# Altium schematic sheet MiCore_MCU.SchDoc: MiCore - Main
size A4; DrawnBy: eleqian; Revision: 1.0; SheetNumber: 1; SheetTotal: 3
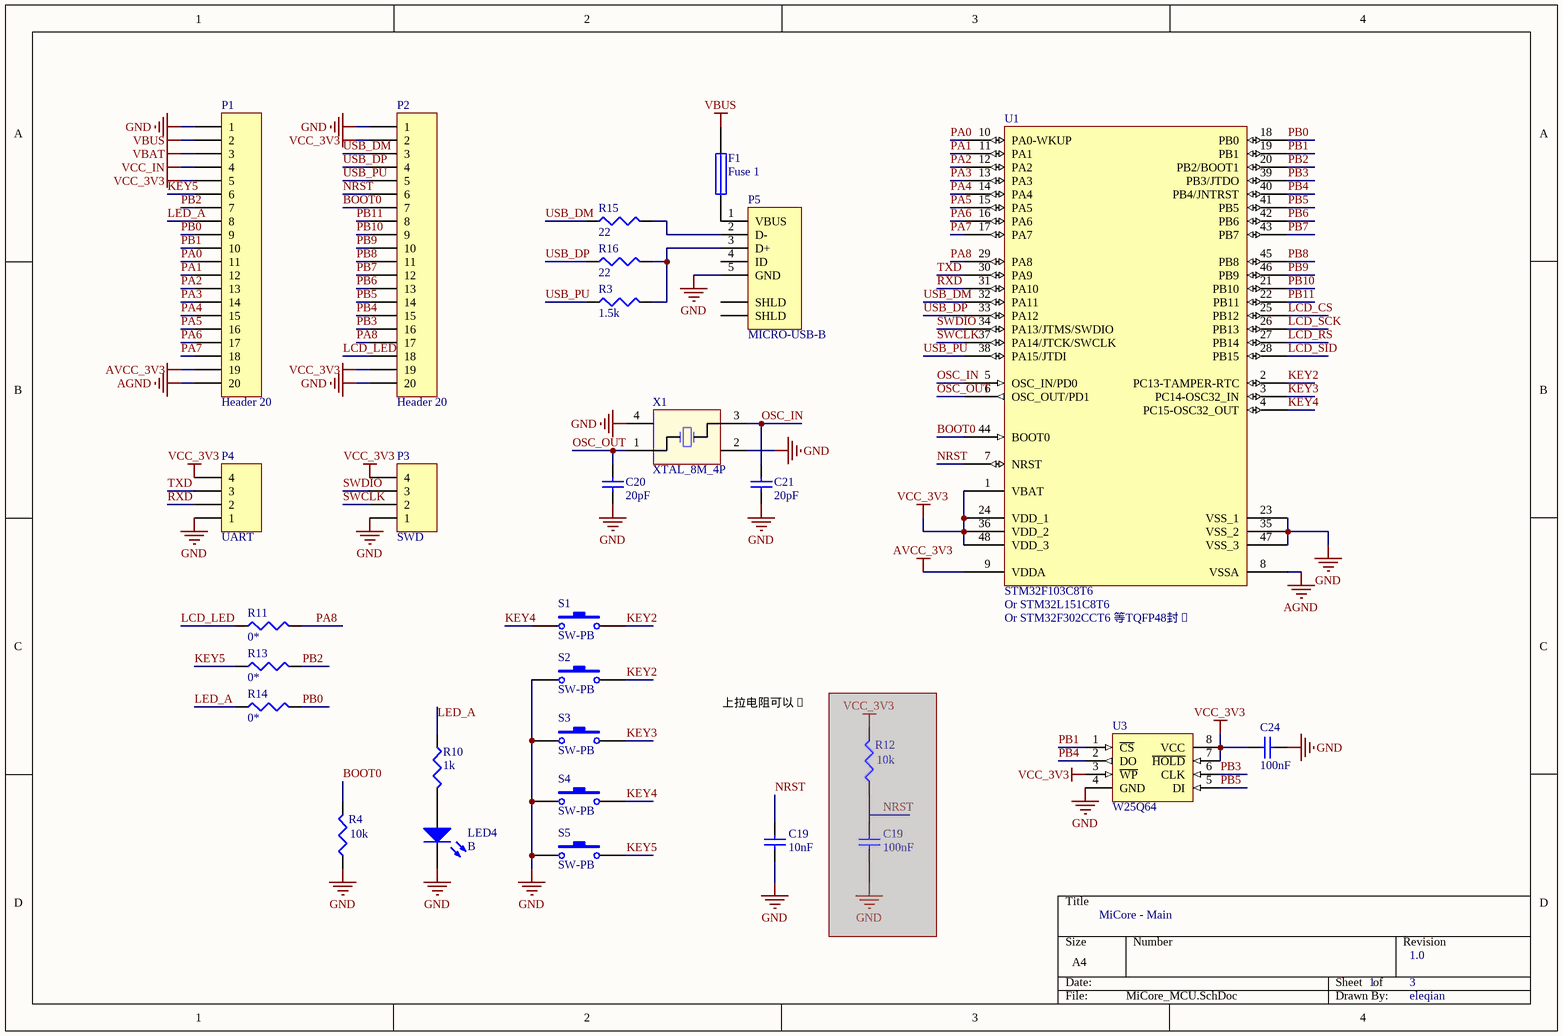
[diagram p0: MiCore_MCU.SchDoc]

## Parts
(Parts that share a designator on the sheet are numbered #1, #2 ... from top to bottom, then left to right.)
C19#1  value 10nF  [0603C]  (hidden comment: Cap)
C19#2  value 100nF  [0603C]  (hidden comment: Cap)  (masked out: inside a compile mask, not in the netlist)
C20  value 20pF  [0603C]  (hidden comment: Cap)
C21  value 20pF  [0603C]  (hidden comment: Cap)
C24  value 100nF  [0603C]  (hidden comment: Cap)
F1  Fuse 1  [0805F]
LED4  B  [0603LED]
P1  Header 20  [HDR1X20]
P2  Header 20  [HDR1X20]
P3  SWD  [HDR1X4]
P4  UART  [HDR1X4]
P5  MICRO-USB-B  [MICRO-USB-B]
R3  value 1.5k  [0603R]  (hidden comment: Res3)
R4  value 10k  [0603R]  (hidden comment: Res3)
R10  value 1k  [0603R]  (hidden comment: Res3)
R11  value 0*  [0603R]  (hidden comment: Res3)
R12  value 10k  [0603R]  (hidden comment: Res3)  (masked out: inside a compile mask, not in the netlist)
R13  value 0*  [0603R]  (hidden comment: Res3)
R14  value 0*  [0603R]  (hidden comment: Res3)
R15  value 22  [0603R]  (hidden comment: Res3)
R16  value 22  [0603R]  (hidden comment: Res3)
S1  SW-PB  [SPST-SM2]
S2  SW-PB  [SPST-SM2]
S3  SW-PB  [SPST-SM2]
S4  SW-PB  [SPST-SM2]
S5  SW-PB  [SPST-SM2]
U1  STM32F103C8T6  [LQFP48]
U3  W25Q64  [SO8W]
X1  XTAL_8M_4P  [XTAL_5032_4P]

## Nets
AGND: P1.20 U1.8(VSSA)
AVCC_3V3: P1.19 U1.9(VDDA)
GND: C19#1.2 C20.2 C21.2 C24.2 LED4.2(K) P1.1 P2.1 P2.20 P3.1 P4.1 P5.5(GND) R4.1 S2.1 S3.1 S4.1 S5.1 U1.23(VSS_1) U1.35(VSS_2) U1.47(VSS_3) U3.4(GND) X1.2(OSC2) X1.4
VBAT: P1.3
VBUS: F1.2 P1.2
VCC_3V3: C24.1 P1.5 P2.2 P2.19 P3.4 P4.4 U1.1(VBAT) U1.24(VDD_1) U1.36(VDD_2) U1.48(VDD_3) U3.3(~{WP}) U3.7(~{HOLD}) U3.8(VCC)
VCC_IN: P1.4
BOOT0: P2.7 R4.2 U1.44(BOOT0)
KEY2: S1.2 S2.2 U1.2(PC13-TAMPER-RTC)
KEY3: S3.2 U1.3(PC14-OSC32_IN)
KEY4: S1.1 S4.2 U1.4(PC15-OSC32_OUT)
KEY5: P1.6 R13.1 S5.2
LCD_CS: U1.25(PB12)
LCD_LED: P2.18 R11.1
LCD_RS: U1.27(PB14)
LCD_SCK: U1.26(PB13)
LCD_SID: U1.28(PB15)
LED_A: P1.8 R10.1 R14.1
NRST: C19#1.1 P2.6 U1.7(NRST)
OSC_IN: C21.1 U1.5(OSC_IN/PD0) X1.3
OSC_OUT: C20.1 U1.6(OSC_OUT/PD1) X1.1(OSC1)
PA0: P1.11 U1.10(PA0-WKUP)
PA1: P1.12 U1.11(PA1)
PA2: P1.13 U1.12(PA2)
PA3: P1.14 U1.13(PA3)
PA4: P1.15 U1.14(PA4)
PA5: P1.16 U1.15(PA5)
PA6: P1.17 U1.16(PA6)
PA7: P1.18 U1.17(PA7)
PA8: P2.17 R11.2 U1.29(PA8)
PB0: P1.9 R14.2 U1.18(PB0)
PB1: P1.10 U1.19(PB1) U3.1(~{CS})
PB2: P1.7 R13.2 U1.20(PB2/BOOT1)
PB3: P2.16 U1.39(PB3/JTDO) U3.6(CLK)
PB4: P2.15 U1.40(PB4/JNTRST) U3.2(DO)
PB5: P2.14 U1.41(PB5) U3.5(DI)
PB6: P2.13 U1.42(PB6)
PB7: P2.12 U1.43(PB7)
PB8: P2.11 U1.45(PB8)
PB9: P2.10 U1.46(PB9)
PB10: P2.9 U1.21(PB10)
PB11: P2.8 U1.22(PB11)
RXD: P4.2 U1.31(PA10)
SWCLK: P3.2 U1.37(PA14/JTCK/SWCLK)
SWDIO: P3.3 U1.34(PA13/JTMS/SWDIO)
TXD: P4.3 U1.30(PA9)
USB_DM: P2.3 R15.1 U1.32(PA11)
USB_DP: P2.4 R16.1 U1.33(PA12)
USB_PU: P2.5 R3.1 U1.38(PA15/JTDI)
NetF1_1: F1.1 P5.1(VBUS)
NetLED4_1: LED4.1(A) R10.2
NetP5_2: P5.2(D-) R15.2
NetP5_3: P5.3(D+) R3.2 R16.2

Not connected (* = marked no-connect by the designer): P5 4(ID) 6(SHLD) 7(SHLD)

## Notes on the sheet
- (near U1) Or STM32L151C8T6
- (near U1) Or STM32F302CCT6 等TQFP48封�
- 上拉电阻可以�

## Library data of the parts
C19#1 C19#2 C20 C21 C24 = Cap: Capacitor; Published: 8-Jun-2000; LatestRevisionDate: 17-Jul-2002; LatestRevisionNote: Re-released for DXP Platform.; PackageReference: RAD-0.3; Publisher: Altium Limited; PackageDescription: Radial Cap, Thru-Hole; 2 Leads; 0.3 in Pin Spacing
F1 = Fuse 1: Fuse; Published: 8-Jun-2000; LatestRevisionDate: 17-Jul-2002; LatestRevisionNote: Re-released for DXP Platform.; PackageReference: PIN-W2/E2.8; Publisher: Altium Limited; PackageDescription: Thru-Hole; 2 Leads
LED4 = LED2: Typical Blue LED; Published: 8-Jun-2000; LatestRevisionDate: 17-Jul-2002; LatestRevisionNote: Re-released for DXP Platform.; PackageVersion: Feb-2002; PackageReference: 3.2X1.6X1.1; Publisher: Altium Limited
P1 P2 = Header 20: Header, 20-Pin; LatestRevisionDate: 17-Jul-2002; LatestRevisionNote: Re-released for DXP Platform.; Publisher: Altium Limited
P3 P4 = Header 4: Header, 4-Pin; LatestRevisionDate: 17-Jul-2002; LatestRevisionNote: Re-released for DXP Platform.; Publisher: Altium Limited
P5 = MICRO-USB-: MicroUSB母座
R3 R4 R10-R16 = Res3: Resistor; Published: 8-Jun-2000; LatestRevisionDate: 29-May-2009; LatestRevisionNote: IPC-7351 Footprint Added.; PackageReference: J1-0603; Publisher: Altium Limited; PackageDescription: Chip Resistor
S1-S5 = SW-PB: Switch; Published: 24-Mar-1999; LatestRevisionDate: 17-Jul-2002; LatestRevisionNote: Re-released for DXP Platform.; PackageReference: SPST-2; Publisher: Altium Limited
U1 = STM32F103C8T6: STM32 ARM-based 32-bit MCU with 64 Kbytes Flash, 48-pin LQFP, Industrial Temperature; Published: 30-May-2008; DatasheetVersion: rev6, Mar-2008; PackageVersion: Mar-2008; PackageReference: LQFP48; Publisher: Altium Limited; PackageDescription: 48-Pin Low-Profile Quad Flat Pack, 7 x 7 mm Body, 0.5 mm Pitch (LQFP48); ComponentLink1Description: Manufacturer Link; ComponentLink1URL: www.st.com/stm32; ComponentLink2Description: Datasheet; ComponentLink2URL: http://www.st.com/stonline/products/literature/ds/13587.pdf
U3 = W25Q64: SPI Flash
X1 = XTAL4P: 4脚贴片无源晶振